# Altium schematic sheet altium_hier.SchDoc
size A4
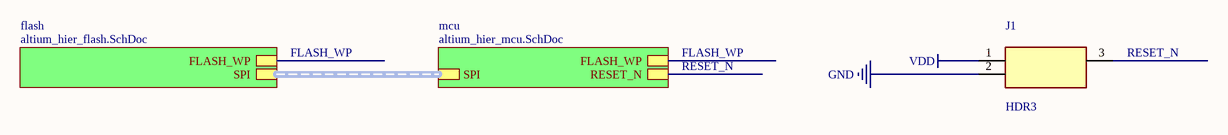
[diagram p0: altium_hier.SchDoc]

## Parts
J1  HDR3  [HDR1X3]

## Sub-sheets
flash = altium_hier_flash.SchDoc: FLASH_WP, SPI (harness SPI)
mcu = altium_hier_mcu.SchDoc: FLASH_WP, RESET_N, SPI (harness SPI)

## Nets
GND: J1.2
VDD: J1.1
FLASH_WP: sheet flash/FLASH_WP, sheet mcu/FLASH_WP
RESET_N: J1.3 ; sheet mcu/RESET_N

## Buses and harness runs
harness sheet flash/SPI = sheet mcu/SPI